# Altium schematic sheet MCORD_AFE.SchDoc: MCORD AFE
size 420 x 297 mm; Author: G.Kasprowicz; CompanyName: WUT ISE; DrawnBy: G.Kasprowicz; Organization: WUT ISE; Address1: PW ISE; Address2: Nowowiejska 15/19 00-665 Warsaw; Address3: gkasprow@gmail.com; DocumentNumber: 1; Revision: 2; SheetNumber: 1; SheetTotal: 4; ModifiedBy: -; CheckedDate: -; Title2: top; DivGrp: WUT ISE; Designer: G.Kasprowicz; ModifiedDate: -; ProjectName: Sensor Box
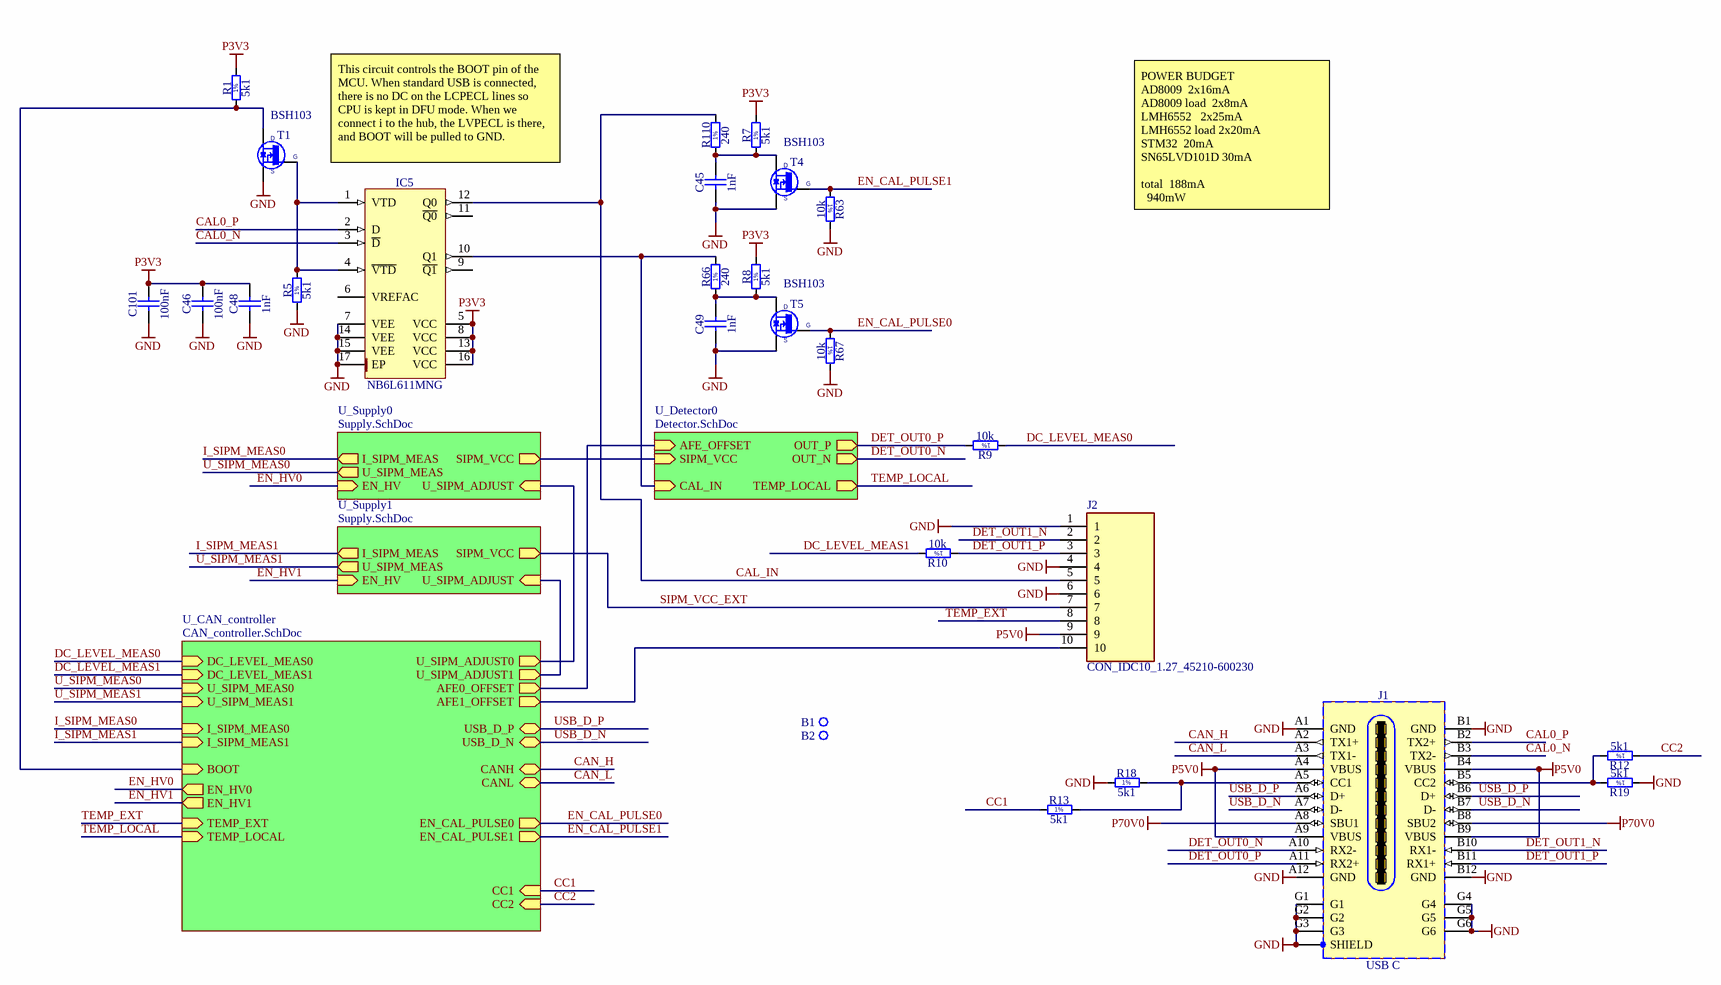
[diagram p0: MCORD_AFE.SchDoc]

## Parts
B1  Plated Hole  [MTG320_550]  (value not drawn)  (no BOM)
B2  Plated Hole  [MTG320_550]  (value not drawn)  (no BOM)
C45  1nF  [CAPC1005X55N]
C46  100nF  [CAPC1005X55N]
C48  1nF  [CAPC1005X55N]
C49  1nF  [CAPC1005X55N]
C101  100nF  [CAPC1005X55N]
IC5  NB6L611MNG  [QFN50P300X300X100-17N-S185]
J1  USB C  [AMPHENOL_MUSBRM5C1M0]
J2  CON_IDC10_1.27_45210-600230  [SHDR10W38P127_2X5_1069X594X747P]
R1  5k1  [RESC1005X40N]
R5  5k1  [RESC1005X40N]
R7  5k1  [RESC1005X40N]
R8  5k1  [RESC1005X40N]
R9  10k  [RESC1005X40N]
R10  10k  [RESC1005X40N]
R12  5k1  [RESC1005X40N]
R13  5k1  [RESC1005X40N]
R18  5k1  [RESC1005X40N]
R19  5k1  [RESC1005X40N]
R63  10k  [RESC1005X40N]
R66  240  [RESC1005X40N]
R67  10k  [RESC1005X40N]
R110  240  [RESC1005X40N]
T1  BSH103  [SOT95P230X110-3N]
T4  BSH103  [SOT95P230X110-3N]
T5  BSH103  [SOT95P230X110-3N]

## Sub-sheets
U_CAN_controller = CAN_controller.SchDoc: CANH (bidir), USB_D_P (bidir), CANL (bidir), USB_D_N (bidir), U_SIPM_ADJUST0 (out), U_SIPM_ADJUST1 (out), EN_HV0 (out), EN_HV1 (out), DC_LEVEL_MEAS0 (in), DC_LEVEL_MEAS1 (in), U_SIPM_MEAS0 (in), U_SIPM_MEAS1 (in), I_SIPM_MEAS0 (in), I_SIPM_MEAS1 (in), TEMP_EXT (in), TEMP_LOCAL (in), EN_CAL_PULSE1 (out), EN_CAL_PULSE0 (out), AFE0_OFFSET (out), AFE1_OFFSET (out), BOOT (in), CC2 (in), CC1 (in)
U_Detector0 = Detector.SchDoc: SIPM_VCC (in), OUT_P (out), OUT_N (out), CAL_IN (in), TEMP_LOCAL (out), AFE_OFFSET (in)
U_Supply0 = Supply.SchDoc: SIPM_VCC (out), U_SIPM_MEAS (out), EN_HV (in), I_SIPM_MEAS (out), U_SIPM_ADJUST (in)
U_Supply1 = Supply.SchDoc: SIPM_VCC (out), U_SIPM_MEAS (out), EN_HV (in), I_SIPM_MEAS (out), U_SIPM_ADJUST (in)

## Nets
GND: C45.1 C46.1 C48.1 C49.1 C101.1 IC5.7(VEE) IC5.14(VEE) IC5.15(VEE) IC5.17(EP) J1.A1(GND) J1.A12(GND) J1.B1(GND) J1.B12(GND) J1.G1 J1.G2 J1.G3 J1.G4 J1.G5 J1.G6 J1.SHIELD J2.1 J2.4 J2.6 R5.1 R18.1 R19.1 R63.2 R67.2 T1.2(S) T4.2(S) T5.2(S)
P3V3: C46.2 C48.2 C101.2 IC5.5(VCC) IC5.8(VCC) IC5.13(VCC) IC5.16(VCC) R1.2 R7.2 R8.2
P5V0: J1.A4(VBUS) J1.A9(VBUS) J1.B4(VBUS) J1.B9(VBUS) J2.9
P70V0: J1.A8(SBU1) J1.B8(SBU2)
CAL0_N: IC5.3(~{D}) J1.B3(TX2-)
CAL0_P: IC5.2(D) J1.B2(TX2+)
CAL_IN: IC5.12(Q0) J2.5 R110.2
CAN_H: J1.A2(TX1+) ; sheet U_CAN_controller/CANH
CAN_L: J1.A3(TX1-) ; sheet U_CAN_controller/CANL
CC1: R13.1 ; sheet U_CAN_controller/CC1
CC2: R12.1 ; sheet U_CAN_controller/CC2
DC_LEVEL_MEAS0: R9.1 ; sheet U_CAN_controller/DC_LEVEL_MEAS0
DC_LEVEL_MEAS1: R10.2 ; sheet U_CAN_controller/DC_LEVEL_MEAS1
DET_OUT0_N: J1.A10(RX2-) ; sheet U_Detector0/OUT_N
DET_OUT0_P: J1.A11(RX2+) R9.2 ; sheet U_Detector0/OUT_P
DET_OUT1_N: J1.B10(RX1-) J2.2
DET_OUT1_P: J1.B11(RX1+) J2.3 R10.1
EN_CAL_PULSE0: R67.1 T5.1(G) ; sheet U_CAN_controller/EN_CAL_PULSE0
EN_CAL_PULSE1: R63.1 T4.1(G) ; sheet U_CAN_controller/EN_CAL_PULSE1
EN_HV0: sheet U_CAN_controller/EN_HV0, sheet U_Supply0/EN_HV
EN_HV1: sheet U_CAN_controller/EN_HV1, sheet U_Supply1/EN_HV
I_SIPM_MEAS0: sheet U_CAN_controller/I_SIPM_MEAS0, sheet U_Supply0/I_SIPM_MEAS
I_SIPM_MEAS1: sheet U_CAN_controller/I_SIPM_MEAS1, sheet U_Supply1/I_SIPM_MEAS
SIPM_VCC_EXT: J2.7 ; sheet U_Supply1/SIPM_VCC
TEMP_EXT: J2.8 ; sheet U_CAN_controller/TEMP_EXT
TEMP_LOCAL: sheet U_CAN_controller/TEMP_LOCAL, sheet U_Detector0/TEMP_LOCAL
U_SIPM_MEAS0: sheet U_CAN_controller/U_SIPM_MEAS0, sheet U_Supply0/U_SIPM_MEAS
U_SIPM_MEAS1: sheet U_CAN_controller/U_SIPM_MEAS1, sheet U_Supply1/U_SIPM_MEAS
USB_D_N: J1.A7(D-) J1.B7(D-) ; sheet U_CAN_controller/USB_D_N
USB_D_P: J1.A6(D+) J1.B6(D+) ; sheet U_CAN_controller/USB_D_P
NetC45_2: C45.2 R7.1 R110.1 T4.3(D)
NetC49_2: C49.2 R8.1 R66.1 T5.3(D)
NetIC5_1: IC5.1(VTD) IC5.4(~{VTD}) R5.2 T1.1(G)
NetIC5_10: IC5.10(Q1) R66.2 ; sheet U_Detector0/CAL_IN
NetJ1_A5: J1.A5(CC1) R13.2 R18.2
NetJ1_B5: J1.B5(CC2) R12.2 R19.2
NetJ2_10: J2.10 ; sheet U_CAN_controller/AFE1_OFFSET
NetR1_1: R1.1 T1.3(D) ; sheet U_CAN_controller/BOOT
(unnamed): sheet U_CAN_controller/U_SIPM_ADJUST0, sheet U_Supply0/U_SIPM_ADJUST
(unnamed): sheet U_CAN_controller/U_SIPM_ADJUST1, sheet U_Supply1/U_SIPM_ADJUST
(unnamed): sheet U_CAN_controller/AFE0_OFFSET, sheet U_Detector0/AFE_OFFSET
(unnamed): sheet U_Detector0/SIPM_VCC, sheet U_Supply0/SIPM_VCC

Not connected (* = marked no-connect by the designer): B1 1; B2 1; IC5 6(VREFAC) 9(~{Q1}) 11(~{Q0})

## Notes on the sheet
- This circuit controls the BOOT pin of the MCU. When standard USB is connected, there is no DC on the LCPECL lines so CPU is kept in DFU mode. When we connect i to the hub, the LVPECL is there, and BOOT will be pulled to GND.
- POWER BUDGET
  AD8009		2x16mA
  AD8009 load 	2x8mA
  LMH6552	 	2x25mA
  LMH6552 load	2x20mA
  STM32		20mA
  SN65LVD101D	30mA
  total		188mA
  940mW
- Project/Equipment
- Document
- Designer
- Drawn by
- Check.by
- Copyright WUT ISE 2018.
  This documentation describes Open Hardware and is licensed under the CERN OHL v.1.1. You may redistribute and modify this documentation under the terms of the CERN OHL v.1.1. (http://ohwr.org/CERNOHL). This documentation is distributed WITHOUT ANY EXPRESS OR IMPLIED WARRANTY, INCLUDING OF MERCHANTABILITY, SATISFACTORY QUALITY AND FITNESS FOR A PARTICULAR PURPOSE. Please see the CERN OHL v.1.1 for applicable conditions.
- Contact
- File
- Last Mod.
- Print Date
- Sheet
- Size
- A3
- of
- Rev
- (in symbol R0402_5K1_1%_0.0625W_100PPM) 1%
- (in symbol R0402_10K_1%_0.0625W_100PPM) 1%
- (in symbol R0402_240R_1%_0.0625W_100PPM) 1%

## Library data of the parts
B1 B2 = PLATED_HOLE3.2_PAD5.5: Single Terminal Socket; Part Description: Plated Through Hole: Hole Dia.=3.2mm Pad Dia.=5.5mm; Mounted: No; Part Number: PLATED_HOLE3.2_PAD5.5; Component Type: Standard (No BOM); Pin Count: 1; Family: Plated Hole; Socket: No; SMD: No; Sense: No; Status: None; ComponentHeight: 0mm; HelpURL: Undefined; Author: CERN DEM JMW; CreateDate: 01.10.2012; LatestRevisionDate: 01.10.2012; PackageDescription: Plated Through Hole: Hole Dia.=3.2mm Pad Dia.=5.5mm
C45 C48 C49 = CC0402_1NF_50V_5%_C0G: Non-polarised capacitor; Part Description: SMD Multilayer Chip Ceramic Capacitor; Manufacturer: GENERIC; Manufacturer1 Part Number: C0402C102J5GACTU; Voltage: 50V; TC: C0G/NP0; Tolerance: ±5%; Part Number: CC0402_1NF_50V_5%_C0G; Component Kind: Standard; Component Type: Standard; Pin Count: 2; Value: 1nF; Status: Preferred; Manufacturer Part Number: CC0402_1NF_50V_5%_C0G; Case: 0402; Mounted: Yes; Socket: No; SMD: Yes; Sense: No; Manufacturer1 Example: KEMET; Manufacturer1 ComponentHeight: 0.55mm; HelpURL: \\cern.ch\dfs\Applications\Altium\Datasheets\CC0402_C0G_KEMET_(Commercial Grade).pdf; Author: CERN DEM BC; CreateDate: 02/09/2019; LatestRevisionDate: 02/09/2019
C46 C101 = CC0402_100NF_16V_10%_X7R: Non-polarised capacitor; Part Description: SMD Multilayer Chip Ceramic Capacitor; Manufacturer: GENERIC; Manufacturer1 Part Number: GRM155R71C104KA88D; Voltage: 16V; TC: X7R; Tolerance: ±10%; Part Number: CC0402_100NF_16V_10%_X7R; Component Kind: Standard; Component Type: Standard; Pin Count: 2; Value: 100nF; Status: Not Recommended; Manufacturer Part Number: CC0402_100NF_16V_10%_X7R; Case: 0402; Mounted: Yes; Socket: No; SMD: Yes; Sense: No; HelpURL: \\cern.ch\dfs\Applications\Altium\Datasheets\CC0402_X7R_MURATA_GRM.pdf; Author: CERN DEM JLC; CreateDate: 05.12.2013; LatestRevisionDate: 03.12.2007; Manufacturer1 Example: MURATA; Manufacturer1 ComponentHeight: 0.55mm
IC5 = NB6L611MNG: 2.5V/3.3V 1:2 Differential LVPECL Clock / Data Fanout Buffer; Manufacturer: ON SEMICONDUCTOR; PressFit: No; Bonding: No; Part Number: NB6L611MNG; Component Kind: Standard; Component Type: Standard; Device: NB6L611MNG; PackageDescription: QFN,0.50mm pitch,square; 4 pin X 4 pin, 3mm X 3mm X 1.00mm H body (w/thermal tab 1.85 X 1.85mm),  IPC Medium Density; Part Description: 2.5V/3.3V 1:2 Differential LVPECL Clock / Data Fanout Buffer; Manufacturer Part Number: NB6L611MNG; Pin Count: 17; Case: QFN16; Mounted: Yes; Socket: No; SMD: Yes; Sense: No; ComponentHeight: 1mm; Author: CERN DEM JLC; HelpURL: \\cern.ch\dfs\Applications\Altium\Datasheets\NB6L611MNG.pdf; CreateDate: 21.02.2018; LatestRevisionDate: 21.02.2018
J1 = AMPHENOL_MUSBRM5C1M0: 2x12 Pin + 6G + 1 Shield  USB Type C Receptacle; Part Description: 1 Port Vertical Receptacle 24 Contacts Rugged USB Type C Input Output Connector; PressFit: No; Part Number: AMPHENOL_MUSBRM5C1M0; Component Kind: Standard; Component Type: Standard; Pin Count: 31; Family: USB C; Mounted: Yes; Socket: No; SMD: No; Sense: No; Status: None; Manufacturer: AMPHENOL; Manufacturer Part Number: MUSBRM5C1M0; ComponentHeight: 14.95mm; HelpURL: \\cern.ch\dfs\Applications\Altium\Datasheets\AMPHENOL_MUSBRM5C1M0.pdf; Author: CERN DEM BC; CreateDate: 26/02/2020; LatestRevisionDate: 26/02/2020
J2 = CON_IDC10_1.27_45210-600230: Connector; Manufacturer_Name: 3M; Allied_Number: 70331440; Datasheet Link: http://multimedia.3m.com/mws/media/905148O/3m-shrouded-boardmount-header-452-series-cd2437.pdf; Height: 7.468mm; Manufacturer_Part_Number: 45210-600230; Mouser Part Number: 517-45210-600230; Mouser Price/Stock: https://www.mouser.com/Search/Refine.aspx?Keyword=517-45210-600230; RS Part Number: 8273691; RS Price/Stock: https://uk.rs-online.com/web/p/products/8273691; Allied Price/Stock: https://www.alliedelec.com/3m-45210-600230/70331440/
R1 R5 R7 R8 R12 R13 R18 R19 = R0402_5K1_1%_0.0625W_100PPM: Resistor - 1%; Part Description: General Purpose Thick Film Chip Resistor; Manufacturer: GENERIC; Manufacturer1 Part Number: 232270675102L; TC: ±100ppm/°C; PressFit: No; Part Number: R0402_5K1_1%_0.0625W_100PPM; Component Kind: Standard; Component Type: Standard; Pin Count: 2; Value: 5k1; Status: Not Recommended; Power: 0.0625W; Tolerance: ±1%; Manufacturer Part Number: R0402_5K1_1%_0.0625W_100PPM; Case: 0402; Mounted: Yes; Sense: No; Socket: No; SMD: Yes; Manufacturer1 Example: YAGEO PHYCOMP; Manufacturer1 ComponentHeight: 0.4mm; HelpURL: \\cern.ch\dfs\Applications\Altium\Datasheets\R0402_Phycomp_RC0402.pdf; Author: CERN DEM JLC; CreateDate: 03.12.2007; LatestRevisionDate: 17.10.2012
R9 R10 R63 R67 = R0402_10K_1%_0.0625W_100PPM: Resistor - 1%; Part Description: General Purpose Thick Film Chip Resistor; Manufacturer: GENERIC; Manufacturer1 Part Number: 232270671003L; TC: ±100ppm/°C; PressFit: No; Part Number: R0402_10K_1%_0.0625W_100PPM; Component Kind: Standard; Component Type: Standard; Pin Count: 2; Value: 10k; Status: Not Recommended; Power: 0.0625W; Tolerance: ±1%; Manufacturer Part Number: R0402_10K_1%_0.0625W_100PPM; Case: 0402; Mounted: Yes; Sense: No; Socket: No; SMD: Yes; Manufacturer1 Example: YAGEO PHYCOMP; Manufacturer1 ComponentHeight: 0.4mm; HelpURL: \\cern.ch\dfs\Applications\Altium\Datasheets\R0402_Phycomp_RC0402.pdf; Author: CERN DEM JLC; CreateDate: 03.12.2007; LatestRevisionDate: 17.10.2012
R66 R110 = R0402_240R_1%_0.0625W_100PPM: Resistor - 1%; Part Description: General Purpose Thick Film Chip Resistor; Manufacturer: GENERIC; Manufacturer1 Part Number: 232270672401L; TC: ±100ppm/°C; PressFit: No; Part Number: R0402_240R_1%_0.0625W_100PPM; Component Kind: Standard; Component Type: Standard; Pin Count: 2; Value: 240; Status: Not Recommended; Power: 0.0625W; Tolerance: ±1%; Manufacturer Part Number: R0402_240R_1%_0.0625W_100PPM; Case: 0402; Mounted: Yes; Sense: No; Socket: No; SMD: Yes; Manufacturer1 Example: YAGEO PHYCOMP; Manufacturer1 ComponentHeight: 0.4mm; HelpURL: \\cern.ch\dfs\Applications\Altium\Datasheets\R0402_Phycomp_RC0402.pdf; Author: CERN DEM JLC; CreateDate: 03.12.2007; LatestRevisionDate: 17.10.2012
T1 T4 T5 = BSH103: N-CHANNEL MOSFET WITH DIODE; Part Description: 30V 850mA N-Channel Enhancement Mode Field-Effect Transistor; Manufacturer: NEXPERIA; PressFit: No; Bonding: No; Part Number: BSH103; Component Kind: Standard; Component Type: Standard; Device: BSH103; PackageDescription: SOT23, 3 pin, Pitch 0.95mm - 1.3mm W X 2.9mm L X 1.1mm H, IPC Medium Density; Manufacturer Part Number: BSH103; Pin Count: 3; Case: SOT23-3; Mounted: Yes; Socket: No; SMD: Yes; Sense: No; ComponentHeight: 1.1mm; HelpURL: \\cern.ch\dfs\Applications\Altium\Datasheets\BSH103.pdf; Author: CERN DEM JLC; CreateDate: 16/03/2010; LatestRevisionDate: 20/06/2017